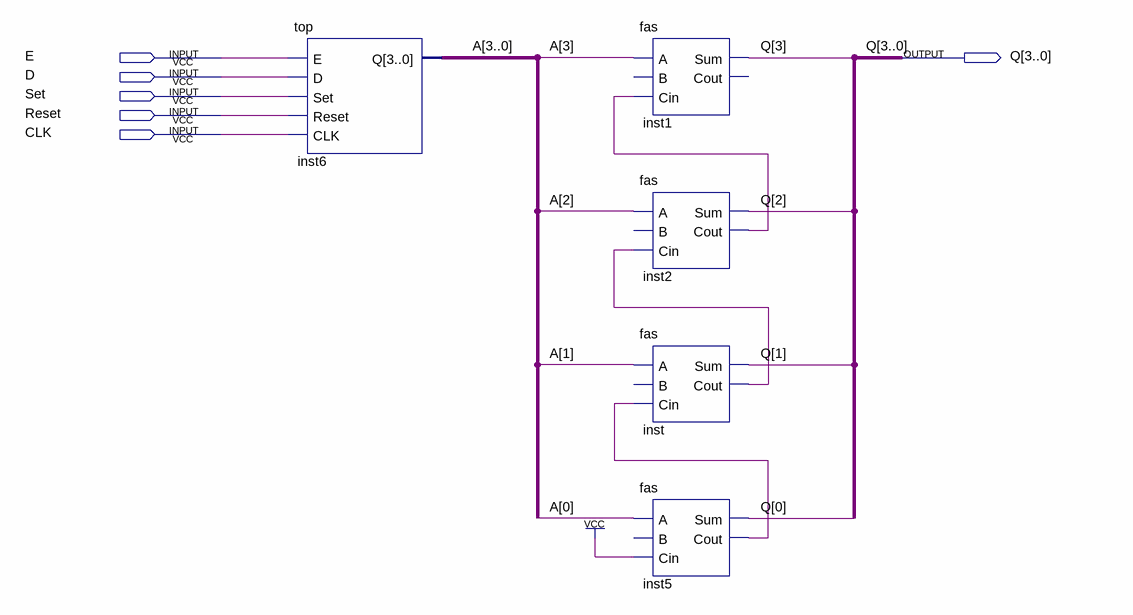
[diagram p0: schematic sheet]
// Quartus schematic top-1.bdf as structural Verilog: 5 symbols, 6 pins
module \top-1  (
  input  E,
  input  D,
  input  Set,
  input  Reset,
  input  CLK,
  output [3:0] Q
);

  wire inst2_cout, inst5_cout, inst_cout;
  wire [3:0] A;

  top inst6 (.E(E), .D(D), .Set(Set), .Reset(Reset), .CLK(CLK), .Q(A));
  fas inst1 (.A(A[3]), .Cin(inst2_cout), .Sum(Q[3]));  // open: B, Cout
  fas inst2 (.A(A[2]), .Cin(inst_cout), .Sum(Q[2]), .Cout(inst2_cout));  // open: B
  fas inst (.A(A[1]), .Cin(inst5_cout), .Sum(Q[1]), .Cout(inst_cout));  // open: B
  fas inst5 (.A(A[0]), .Cin(1'b1), .Sum(Q[0]), .Cout(inst5_cout));  // open: B
endmodule
